# EAGLE design PIC16F877_board (EAGLE 7.2.0)
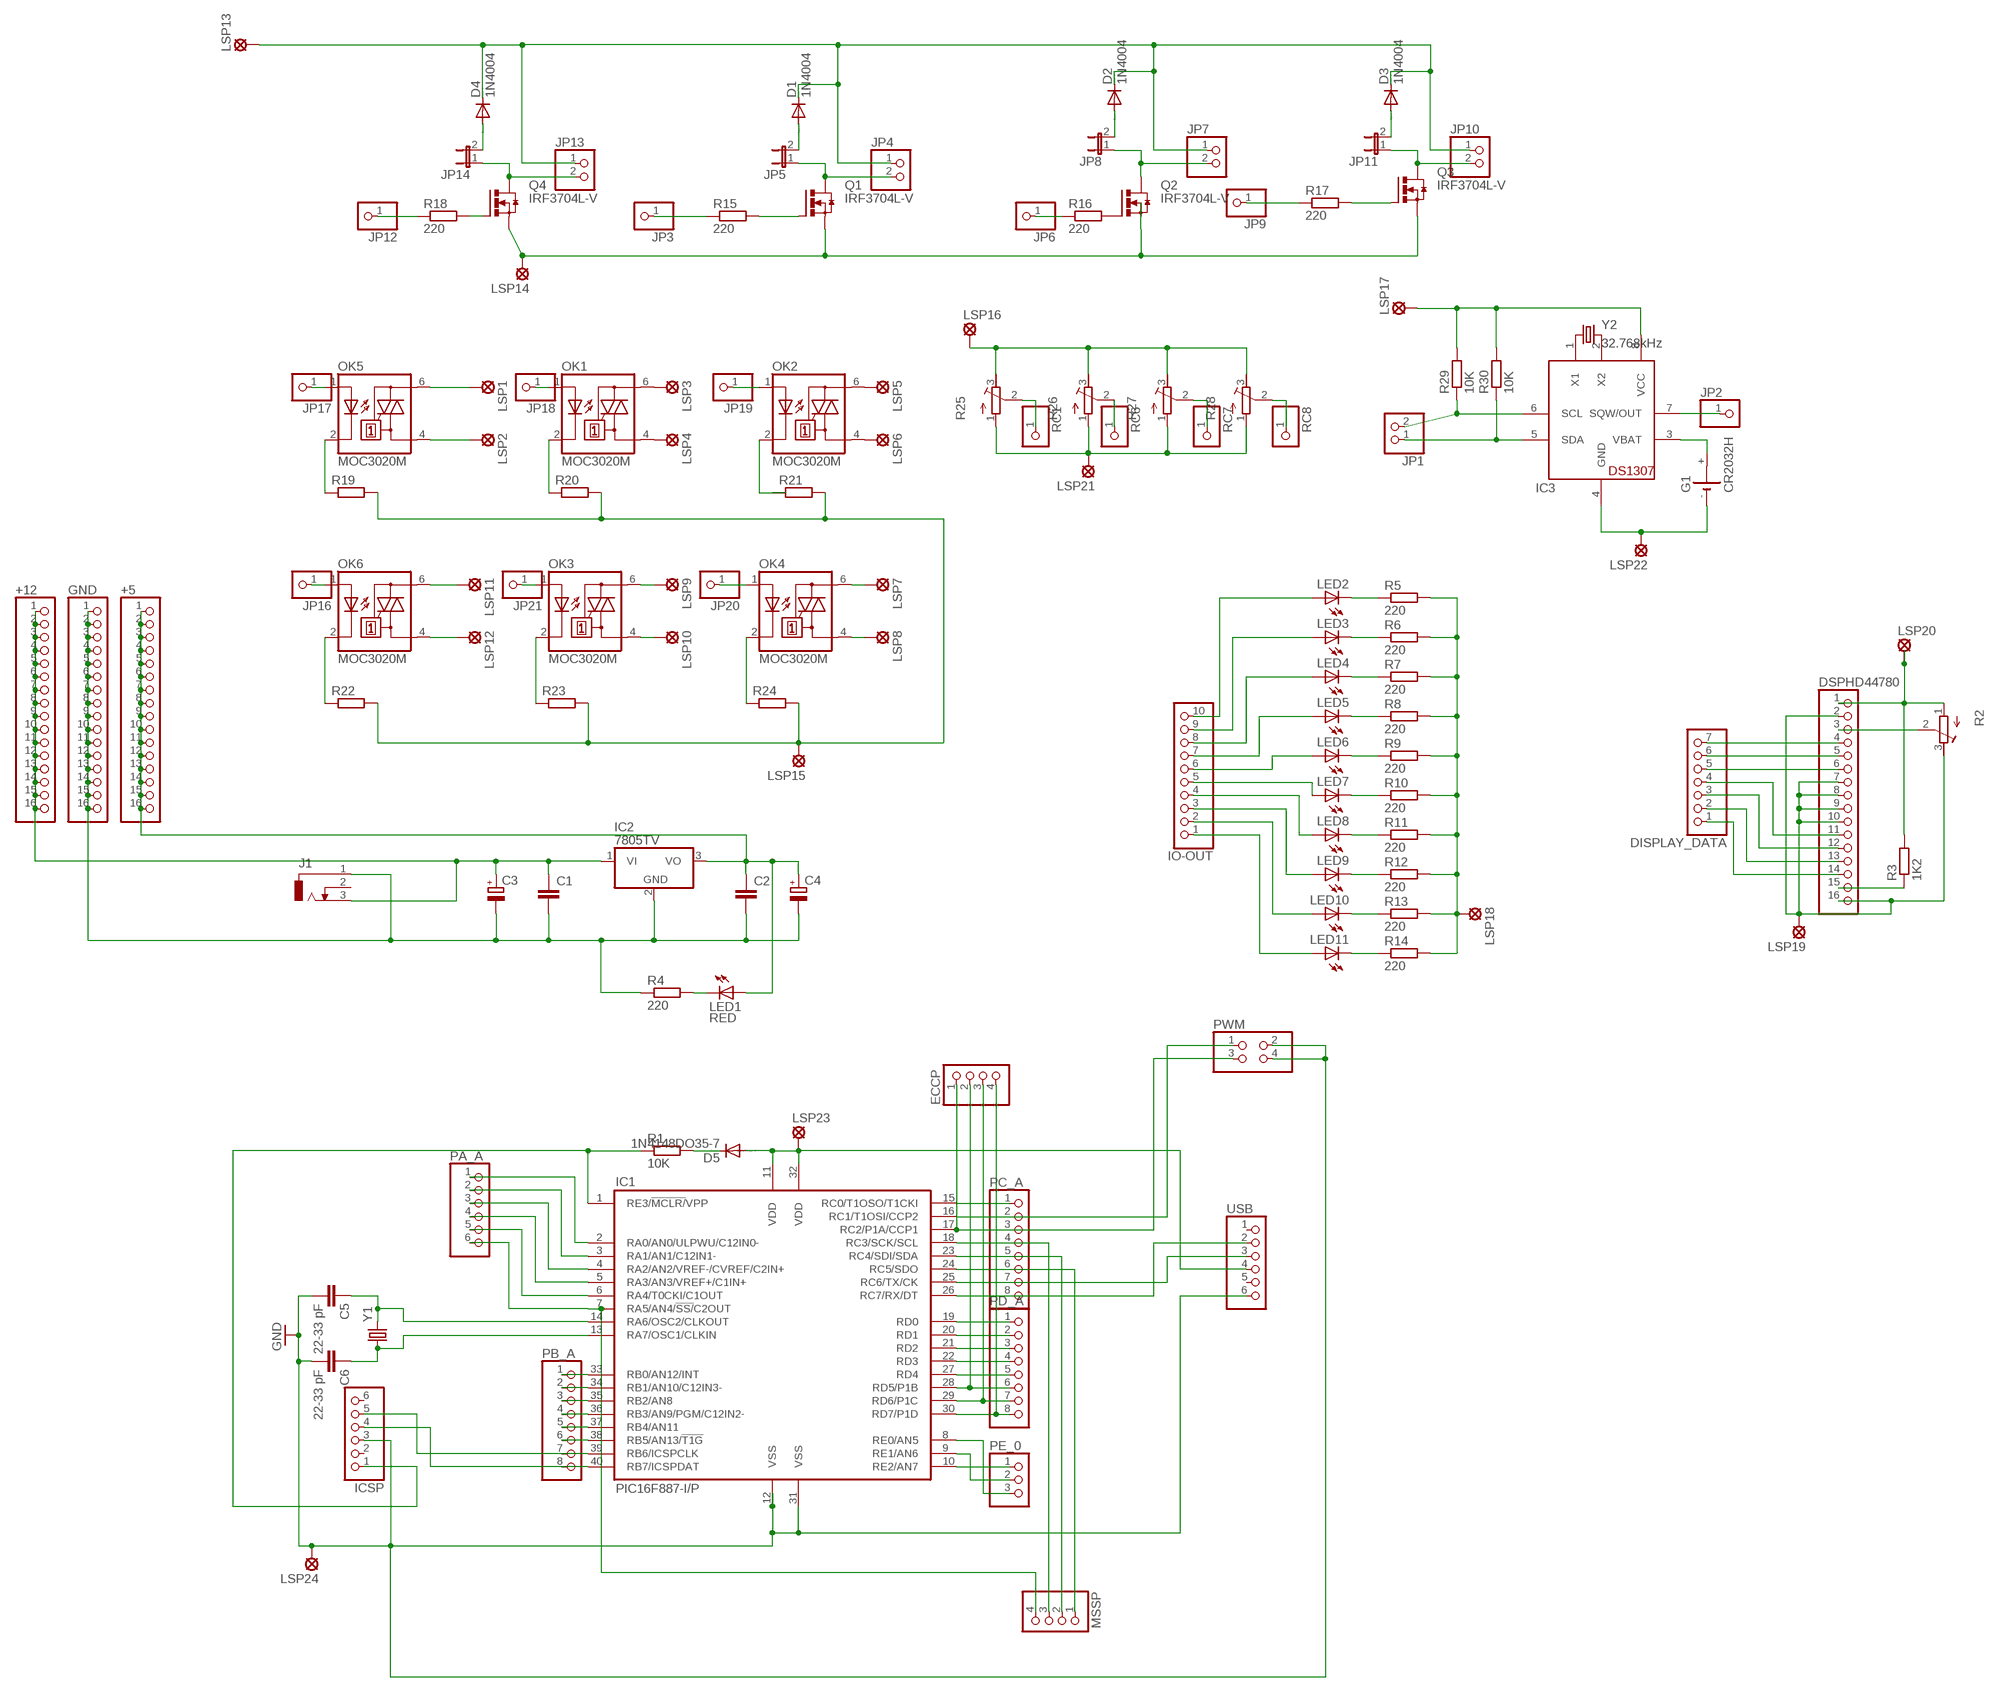
[diagram p0: schematic, sheet 1]

## Parts
+5  PINHD-1X16  [1X16]
+12  PINHD-1X16  [1X16]
C1  C-EU050-025X075  [C050-025X075]
C2  C-EU050-025X075  [C050-025X075]
C3  CPOL-EUE2,5-6E  [E2,5-6E]
C4  CPOL-EUE2,5-6E  [E2,5-6E]
C5  22-33 pF  C-EU025-024X044  [C025-024X044]
C6  22-33 pF  C-EU025-024X044  [C025-024X044]
D1  1N4004  [DO41-10]
D2  1N4004  [DO41-10]
D3  1N4004  [DO41-10]
D4  1N4004  [DO41-10]
D5  1N4148DO35-7  [DO35-7]
DISPLAY_DATA  PINHD-1X7  [1X07]
DSPHD44780  PINHD-1X16  [1X16]
ECCP  PINHD-1X4  [1X04]
G1  CR2032H  [CR2032H]
GND  PINHD-1X16  [1X16]
IC1  PIC16F887-I/P  [DIL40]
IC2  7805TV  [TO220V]
IC3  DS1307  [DIL08]
ICSP  PINHD-1X6  [1X06]
IO-OUT  PINHD-1X10  [1X10]
J1  DCJ0303  [DCJ0303]
JP1  PINHD-1X2  [1X02]
JP2  PINHD-1X1  [1X01]
JP3  PINHD-1X1  [1X01]
JP4  PINHD-1X2  [1X02]
JP5  JP1E  [JP1]
JP6  PINHD-1X1  [1X01]
JP7  PINHD-1X2  [1X02]
JP8  JP1E  [JP1]
JP9  PINHD-1X1  [1X01]
JP10  PINHD-1X2  [1X02]
JP11  JP1E  [JP1]
JP12  PINHD-1X1  [1X01]
JP13  PINHD-1X2  [1X02]
JP14  JP1E  [JP1]
JP16  PINHD-1X1  [1X01]
JP17  PINHD-1X1  [1X01]
JP18  PINHD-1X1  [1X01]
JP19  PINHD-1X1  [1X01]
JP20  PINHD-1X1  [1X01]
JP21  PINHD-1X1  [1X01]
LED1  RED  LED5MM  [LED5MM]
LED2  LED3MM  [LED3MM]
LED3  LED3MM  [LED3MM]
LED4  LED3MM  [LED3MM]
LED5  LED3MM  [LED3MM]
LED6  LED3MM  [LED3MM]
LED7  LED3MM  [LED3MM]
LED8  LED3MM  [LED3MM]
LED9  LED3MM  [LED3MM]
LED10  LED3MM  [LED3MM]
LED11  LED3MM  [LED3MM]
LSP1  LSP10  [LSP10]
LSP2  LSP10  [LSP10]
LSP3  LSP10  [LSP10]
LSP4  LSP10  [LSP10]
LSP5  LSP10  [LSP10]
LSP6  LSP10  [LSP10]
LSP7  LSP10  [LSP10]
LSP8  LSP10  [LSP10]
LSP9  LSP10  [LSP10]
LSP10  LSP10  [LSP10]
LSP11  LSP10  [LSP10]
LSP12  LSP10  [LSP10]
LSP13  LSP10  [LSP10]
LSP14  LSP10  [LSP10]
LSP15  LSP10  [LSP10]
LSP16  LSP10  [LSP10]
LSP17  LSP10  [LSP10]
LSP18  LSP10  [LSP10]
LSP19  LSP10  [LSP10]
LSP20  LSP10  [LSP10]
LSP21  LSP10  [LSP10]
LSP22  LSP10  [LSP10]
LSP23  LSP10  [LSP10]
LSP24  LSP10  [LSP10]
MSSP  PINHD-1X4  [1X04]
OK1  MOC3020M  [DIL06]
OK2  MOC3020M  [DIL06]
OK3  MOC3020M  [DIL06]
OK4  MOC3020M  [DIL06]
OK5  MOC3020M  [DIL06]
OK6  MOC3020M  [DIL06]
PA_A  PINHD-1X6  [1X06]
PB_A  PINHD-1X8  [1X08]
PC_A  PINHD-1X8  [1X08]
PD_A  PINHD-1X8  [1X08]
PE_0  PINHD-1X3  [1X03]
PWM  PINHD-2X2  [2X02]
Q1  IRF3704L-V  [TO262-V]
Q2  IRF3704L-V  [TO262-V]
Q3  IRF3704L-V  [TO262-V]
Q4  IRF3704L-V  [TO262-V]
R1  10K  R-EU_0207/10  [0207/10]
R2  R-TRIMM3339P  [RTRIM3339P]
R3  1K2  R-EU_0207/10  [0207/10]
R4  220  R-EU_0207/10  [0207/10]
R5  220  R-EU_0207/10  [0207/10]
R6  220  R-EU_0207/10  [0207/10]
R7  220  R-EU_0207/10  [0207/10]
R8  220  R-EU_0207/10  [0207/10]
R9  220  R-EU_0207/10  [0207/10]
R10  220  R-EU_0207/10  [0207/10]
R11  220  R-EU_0207/10  [0207/10]
R12  220  R-EU_0207/10  [0207/10]
R13  220  R-EU_0207/10  [0207/10]
R14  220  R-EU_0207/10  [0207/10]
R15  220  R-EU_0207/10  [0207/10]
R16  220  R-EU_0207/10  [0207/10]
R17  220  R-EU_0207/10  [0207/10]
R18  220  R-EU_0207/10  [0207/10]
R19  R-EU_0207/10  [0207/10]
R20  R-EU_0207/10  [0207/10]
R21  R-EU_0207/10  [0207/10]
R22  R-EU_0207/10  [0207/10]
R23  R-EU_0207/10  [0207/10]
R24  R-EU_0207/10  [0207/10]
R25  R-TRIMM3339P  [RTRIM3339P]
R26  R-TRIMM3339P  [RTRIM3339P]
R27  R-TRIMM3339P  [RTRIM3339P]
R28  R-TRIMM3339P  [RTRIM3339P]
R29  10K  R-EU_0207/10  [0207/10]
R30  10K  R-EU_0207/10  [0207/10]
RC1  PINHD-1X1  [1X01]
RC6  PINHD-1X1  [1X01]
RC7  PINHD-1X1  [1X01]
RC8  PINHD-1X1  [1X01]
USB  PINHD-1X6  [1X06]
Y1  CRYSTALHC49UV  [HC49U-V]
Y2  32.768kHz  CRYSTALTC26V  [TC26V]

## Nets
GND: C5.2 C6.2 IC1.12(VSS) IC1.31(VSS) ICSP.3 LSP24.MP PWM.2 PWM.4 USB.6
N$1: C5.1 IC1.14(RA6/OSC2/CLKOUT) Y1.2
N$2: LED1.K(C) R4.2
N$3: IC1.15(RC0/T1OSO/T1CKI) PC_A.1
N$4: IC1.33(RB0/AN12/INT) PB_A.1
N$5: IC1.34(RB1/AN10/C12IN3-) PB_A.2
N$6: IC1.35(RB2/AN8) PB_A.3
N$7: IC1.36(RB3/AN9/PGM/C12IN2-) PB_A.4
N$8: IC1.2(RA0/AN0/ULPWU/C12IN0-) PA_A.1
N$9: IC1.3(RA1/AN1/C12IN1-) PA_A.2
N$10: IC1.4(RA2/AN2/VREF-/CVREF/C2IN+) PA_A.3
N$11: IC1.5(RA3/AN3/VREF+/C1IN+) PA_A.4
N$12: IC1.6(RA4/T0CKI/C1OUT) PA_A.5
N$13: IC1.7(RA5/AN4/!SS/!C2OUT) MSSP.4 PA_A.6
N$14: DISPLAY_DATA.5 DSPHD44780.6
N$15: IC1.1(RE3/!MCLR/!VPP) ICSP.1 R1.1
N$16: DISPLAY_DATA.6 DSPHD44780.5
N$17: IC1.19(RD0) PD_A.1
N$18: IC1.37(RB4/AN11) PB_A.5
N$19: IC1.38(RB5/AN13/!T1G) PB_A.6
N$20: IC1.39(RB6/ICSPCLK) ICSP.5 PB_A.7
N$21: IC1.40(RB7/ICSPDAT) ICSP.4 PB_A.8
N$22: DSPHD44780.15 R3.1
N$23: IC1.20(RD1) PD_A.2
N$24: IC1.16(RC1/T1OSI/CCP2) PC_A.2 PWM.1
N$25: C6.1 IC1.13(RA7/OSC1/CLKIN) Y1.1
N$26: C1.2 C2.2 C3.- C4.- GND.1 GND.2 GND.3 GND.4 GND.5 GND.6 GND.7 GND.8 GND.9 GND.10 GND.11 GND.12 GND.13 GND.14 GND.15 GND.16 IC2.2(GND) J1.1 R4.1
N$27: IC1.18(RC3/SCK/SCL) MSSP.3 PC_A.4
N$28: IC1.23(RC4/SDI/SDA) MSSP.2 PC_A.5
N$29: IC1.24(RC5/SDO) MSSP.1 PC_A.6
N$30: IC1.25(RC6/TX/CK) PC_A.7 USB.3
N$31: IC1.26(RC7/RX/DT) PC_A.8 USB.2
N$32: IC1.21(RD2) PD_A.3
N$33: IC1.22(RD3) PD_A.4
N$34: IC1.27(RD4) PD_A.5
N$35: ECCP.2 IC1.28(RD5/P1B) PD_A.6
N$36: ECCP.3 IC1.29(RD6/P1C) PD_A.7
N$37: ECCP.4 IC1.30(RD7/P1D) PD_A.8
N$38: ECCP.1 IC1.17(RC2/P1A/CCP1) PC_A.3 PWM.3
N$39: JP17.1 OK5.1(A)
N$40: Q1.1(G) R15.2
N$41: LED2.K(C) R5.1
N$42: LED3.K(C) R6.1
N$43: LED4.K(C) R7.1
N$44: LED5.K(C) R8.1
N$45: LED6.K(C) R9.1
N$46: LED7.K(C) R10.1
N$47: LED8.K(C) R11.1
N$48: LED9.K(C) R12.1
N$49: LED10.K(C) R13.1
N$50: LED11.K(C) R14.1
N$51: JP3.1 R15.1
N$52: IO-OUT.10 LED2.A
N$53: IO-OUT.9 LED3.A
N$54: IO-OUT.8 LED4.A
N$55: IO-OUT.7 LED5.A
N$56: IO-OUT.6 LED6.A
N$57: IO-OUT.5 LED7.A
N$58: IO-OUT.4 LED8.A
N$59: IO-OUT.3 LED9.A
N$60: IO-OUT.2 LED10.A
N$61: IO-OUT.1 LED11.A
N$62: JP4.2 JP5.1 Q1.2(D)
N$63: JP18.1 OK1.1(A)
N$64: JP19.1 OK2.1(A)
N$65: D1.A JP5.2
N$66: JP20.1 OK4.1(A)
N$67: Q2.1(G) R16.2
N$68: JP6.1 R16.1
N$69: JP7.2 JP8.1 Q2.2(D)
N$70: D2.A JP8.2
N$71: Q3.1(G) R17.2
N$72: JP9.1 R17.1
N$73: JP10.2 JP11.1 Q3.2(D)
N$74: D3.A JP11.2
N$75: Q4.1(G) R18.2
N$76: JP12.1 R18.1
N$77: JP13.2 JP14.1 Q4.2(D)
N$78: D4.A JP14.2
N$79: LSP1.MP OK5.6(A2)
N$80: LSP2.MP OK5.4(A1)
N$81: LSP3.MP OK1.6(A2)
N$82: LSP4.MP OK1.4(A1)
N$83: LSP5.MP OK2.6(A2)
N$84: LSP6.MP OK2.4(A1)
N$85: LSP7.MP OK4.6(A2)
N$86: LSP8.MP OK4.4(A1)
N$87: LSP9.MP OK3.6(A2)
N$88: LSP10.MP OK3.4(A1)
N$89: LSP11.MP OK6.6(A2)
N$90: LSP12.MP OK6.4(A1)
N$91: JP21.1 OK3.1(A)
N$92: OK2.2(C) R21.1
N$93: OK1.2(C) R20.1
N$94: OK5.2(C) R19.1
N$95: JP16.1 OK6.1(A)
N$96: OK3.2(C) R23.1
N$97: OK4.2(C) R24.1
N$98: OK6.2(C) R22.1
N$99: DISPLAY_DATA.1 DSPHD44780.14
N$100: R25.2(S) RC1.1
N$101: R26.2(S) RC6.1
N$102: R27.2(S) RC7.1
N$103: R28.2(S) RC8.1
N$104: DISPLAY_DATA.2 DSPHD44780.13
N$105: DISPLAY_DATA.3 DSPHD44780.12
N$106: DISPLAY_DATA.4 DSPHD44780.11
N$107: DISPLAY_DATA.7 DSPHD44780.4
N$108: IC1.9(RE1/AN6) PE_0.2
N$109: DSPHD44780.3 R2.2(S)
N$110: IC1.8(RE0/AN5) PE_0.3
N$111: IC1.10(RE2/AN7) PE_0.1
N$112: D5.C R1.2
N$113: IC3.6(SCL) JP1.2 R29.1
N$114: IC3.5(SDA) JP1.1 R30.1
N$115: IC3.8(VCC) LSP17.MP R29.2 R30.2
N$116: IC3.7(SQW/OUT) JP2.1
N$117: G1.+ IC3.3(VBAT)
N$118: D1.C D2.C D3.C D4.C JP4.1 JP7.1 JP10.1 JP13.1 LSP13.MP
N$119: LSP14.MP Q1.3(S) Q2.3(S) Q3.3(S) Q4.3(S)
N$120: IC3.1(X1) Y2.1
N$121: IC3.2(X2) Y2.2
N$122: LSP15.MP R19.2 R20.2 R21.2 R22.2 R23.2 R24.2
N$123: LSP18.MP R5.2 R6.2 R7.2 R8.2 R9.2 R10.2 R11.2 R12.2 R13.2 R14.2
N$124: LSP16.MP R25.3(E) R26.3(E) R27.3(E) R28.3(E)
N$125: DSPHD44780.1 LSP20.MP R2.1(A) R3.2
N$126: DSPHD44780.2 DSPHD44780.7 DSPHD44780.8 DSPHD44780.9 DSPHD44780.10 DSPHD44780.16 LSP19.MP R2.3(E)
N$127: G1.- IC3.4(GND) LSP22.MP
N$128: LSP21.MP R25.1(A) R26.1(A) R27.1(A) R28.1(A)
N$129: +12.1 +12.2 +12.3 +12.4 +12.5 +12.6 +12.7 +12.8 +12.9 +12.10 +12.11 +12.12 +12.13 +12.14 +12.15 +12.16 C1.1 C3.+ IC2.1(VI) J1.3
N$130: D5.A IC1.11(VDD) IC1.32(VDD) LSP23.MP USB.4
N$131: +5.1 +5.2 +5.3 +5.4 +5.5 +5.6 +5.7 +5.8 +5.9 +5.10 +5.11 +5.12 +5.13 +5.14 +5.15 +5.16 C2.1 C4.+ IC2.3(VO) LED1.A
Unconnected: G1.+@1(+) ICSP.2 ICSP.6 J1.2 USB.1 USB.5

## Library data of the parts
+5 +12 DSPHD44780 GND = pinhead:PINHD-1X16: PIN HEADER
C1 C2 = resistor:C-EU: CAPACITOR, European symbol
C3 C4 = rcl:CPOL-EU: POLARIZED CAPACITOR, European symbol
C5 C6 = rcl:C-EU: CAPACITOR, European symbol
D1-D4 = diode:1N4004: DIODE general purpose rectifier, 1 A
D5 = diode:1N4148: DIODE high speed (Philips)
DISPLAY_DATA = pinhead:PINHD-1X7: PIN HEADER
ECCP MSSP = pinhead:PINHD-1X4: PIN HEADER
G1 = battery:CR2032H: LI BATTERY Varta
IC1 = microchip-pic16f887:PIC16F887: The library has been designed by Richard Magdycz <https://www.facebook.com/groups/eaglecadsoftUK>
IC2 = linear:78*: Positive VOLTAGE REGULATOR Source: http://cache.national.com/ds/LM/LM78L05.pdf http://www.fairchildsemi.com/ds/LM/LM7805.pdf
IC3 = adafruit:DS1307: DS1307 Real time clock (RTC) with battery backup ability. Talk to it via i2c
ICSP PA_A USB = pinhead:PINHD-1X6: PIN HEADER
IO-OUT = pinhead:PINHD-1X10: PIN HEADER
J1 = con-jack:DCJ0303: DC POWER JACK Source: DCJ0303.pdf; OC_FARNELL: unknown; OC_NEWARK: unknown
JP1 JP4 JP7 JP10 JP13 = pinhead:PINHD-1X2: PIN HEADER
JP2 JP3 JP6 JP9 JP12 JP16-JP21 RC1 RC6-RC8 = pinhead:PINHD-1X1: PIN HEADER
JP5 JP8 JP11 JP14 = jumper:JP1E: JUMPER
LED1-LED11 = led:LED: LED OSRAM: - CHIPLED LG R971, LG N971, LY N971, LG Q971, LY Q971, LO R971, LY R971 LH N974, LH R974 LS Q976, LO Q976, LY Q976 LO Q996 - Hyper CHIPLED LW Q18S LB Q993, LB Q99A, LB R99A - SideLED LS A670, LO A670, LY A670, LG A670, LP A670 LB A673, LV A673, LT A673, LW A673 LH A674 LY A675 LS A676, LA A676, LO A676, LY A676, LW A676 LS A679, LY A679, LG A679 - Hyper Micro SIDELED® LS Y876, LA Y876, LO Y876, LY Y876 LT Y87S - SmartLED LW L88C, LW L88S LB L89C, LB L89S, LG L890 LS L89K, LO L89K, LY L89K LS L896, LA L896, LO L896, LY L896 - TOPLED LS T670, LO T670, LY T670, LG T670, LP T670 LSG T670, LSP T670, LSY T670, LOP T670, LYG T670 LG T671, LOG T671, LSG T671 LB T673, LV T673, LT T673, LW T673 LH T674 LS T676, LA T676, LO T676, LY T676, LB T676, LH T676, LSB T676, LW T676 LB T67C, LV T67C, LT T67C, LS T67K, LO T67K, LY T67K, LW E67C LS E67B, LA E67B, LO E67B, LY E67B, LB E67C, LV E67C, LT E67C LW T67C LS T679, LY T679, LG T679 LS T770, LO T770, LY T770, LG T770, LP T770 LB T773, LV T773, LT T773, LW T773 LH T774 LS E675, LA E675, LY E675, LS T675 LS T776, LA T776, LO T776, LY T776, LB T776 LHGB T686 LT T68C, LB T68C - Hyper Mini TOPLED® LB M676 - Mini TOPLED Santana® LG M470 LS M47K, LO M47K, LY M47K Source: http://www.osram.convergy.de LUXEON: - LUMILED® LXK2-PW12-R00, LXK2-PW12-S00, LXK2-PW14-U00, LXK2-PW14-V00 LXK2-PM12-R00, LXK2-PM12-S00, LXK2-PM14-U00 LXK2-PE12-Q00, LXK2-PE12-R00, LXK2-PE12-S00, LXK2-PE14-T00, LXK2-PE14-U00 LXK2-PB12-K00, LXK2-PB12-L00, LXK2-PB12-M00, LXK2-PB14-N00, LXK2-PB14-P00, LXK2-PB14-Q00 LXK2-PR12-L00, LXK2-PR12-M00, LXK2-PR14-Q00, LXK2-PR14-R00 LXK2-PD12-Q00, LXK2-PD12-R00, LXK2-PD12-S00 LXK2-PH12-R00, LXK2-PH12-S00 LXK2-PL12-P00, LXK2-PL12-Q00, LXK2-PL12-R00 Source: www.luxeon.com KINGBRIGHT: KA-3528ASYC Source: www.kingbright.com
LSP1-LSP24 = solpad:LSP10: SOLDER PAD drill 1.0 mm, distributor Buerklin, 12H555
OK1-OK6 = optocoupler:MOC30*M: RANDOM-PHASE OPTOISOLATORS TRIAC DRIVER OUTPUT Source: http://www.fairchildsemi.com MOC3020-M.pdf; MF: FAIRCHILD SEMICONDUCTOR; MPN: MOC3020-M; OC_FARNELL: 1505425; OC_NEWARK: 72K8895
PB_A PC_A PD_A = pinhead:PINHD-1X8: PIN HEADER
PE_0 = pinhead:PINHD-1X3: PIN HEADER
PWM = pinhead:PINHD-2X2: PIN HEADER
Q1-Q4 = transistor-power:IRF3704: SMPS MOSFET HEXFET® Power MOSFET Source: http://www.irf.com/product-info/datasheets/data/irf3704.pdf
R1 R3 R4 R19-R24 R29 R30 = resistor:R-EU_: RESISTOR, European symbol
R2 = rcl:R-TRIMM: Trimm resistor
R5-R18 = rcl:R-EU_: RESISTOR, European symbol
R25-R28 = resistor:R-TRIMM: Trimm resistor
Y1 = SparkFun-FreqCtrl:CRYSTAL: Various standard crystals. Proven footprints.
Y2 = adafruit:CRYSTAL: CRYSTAL; OC_FARNELL: unknown; OC_NEWARK: unknown

## Board
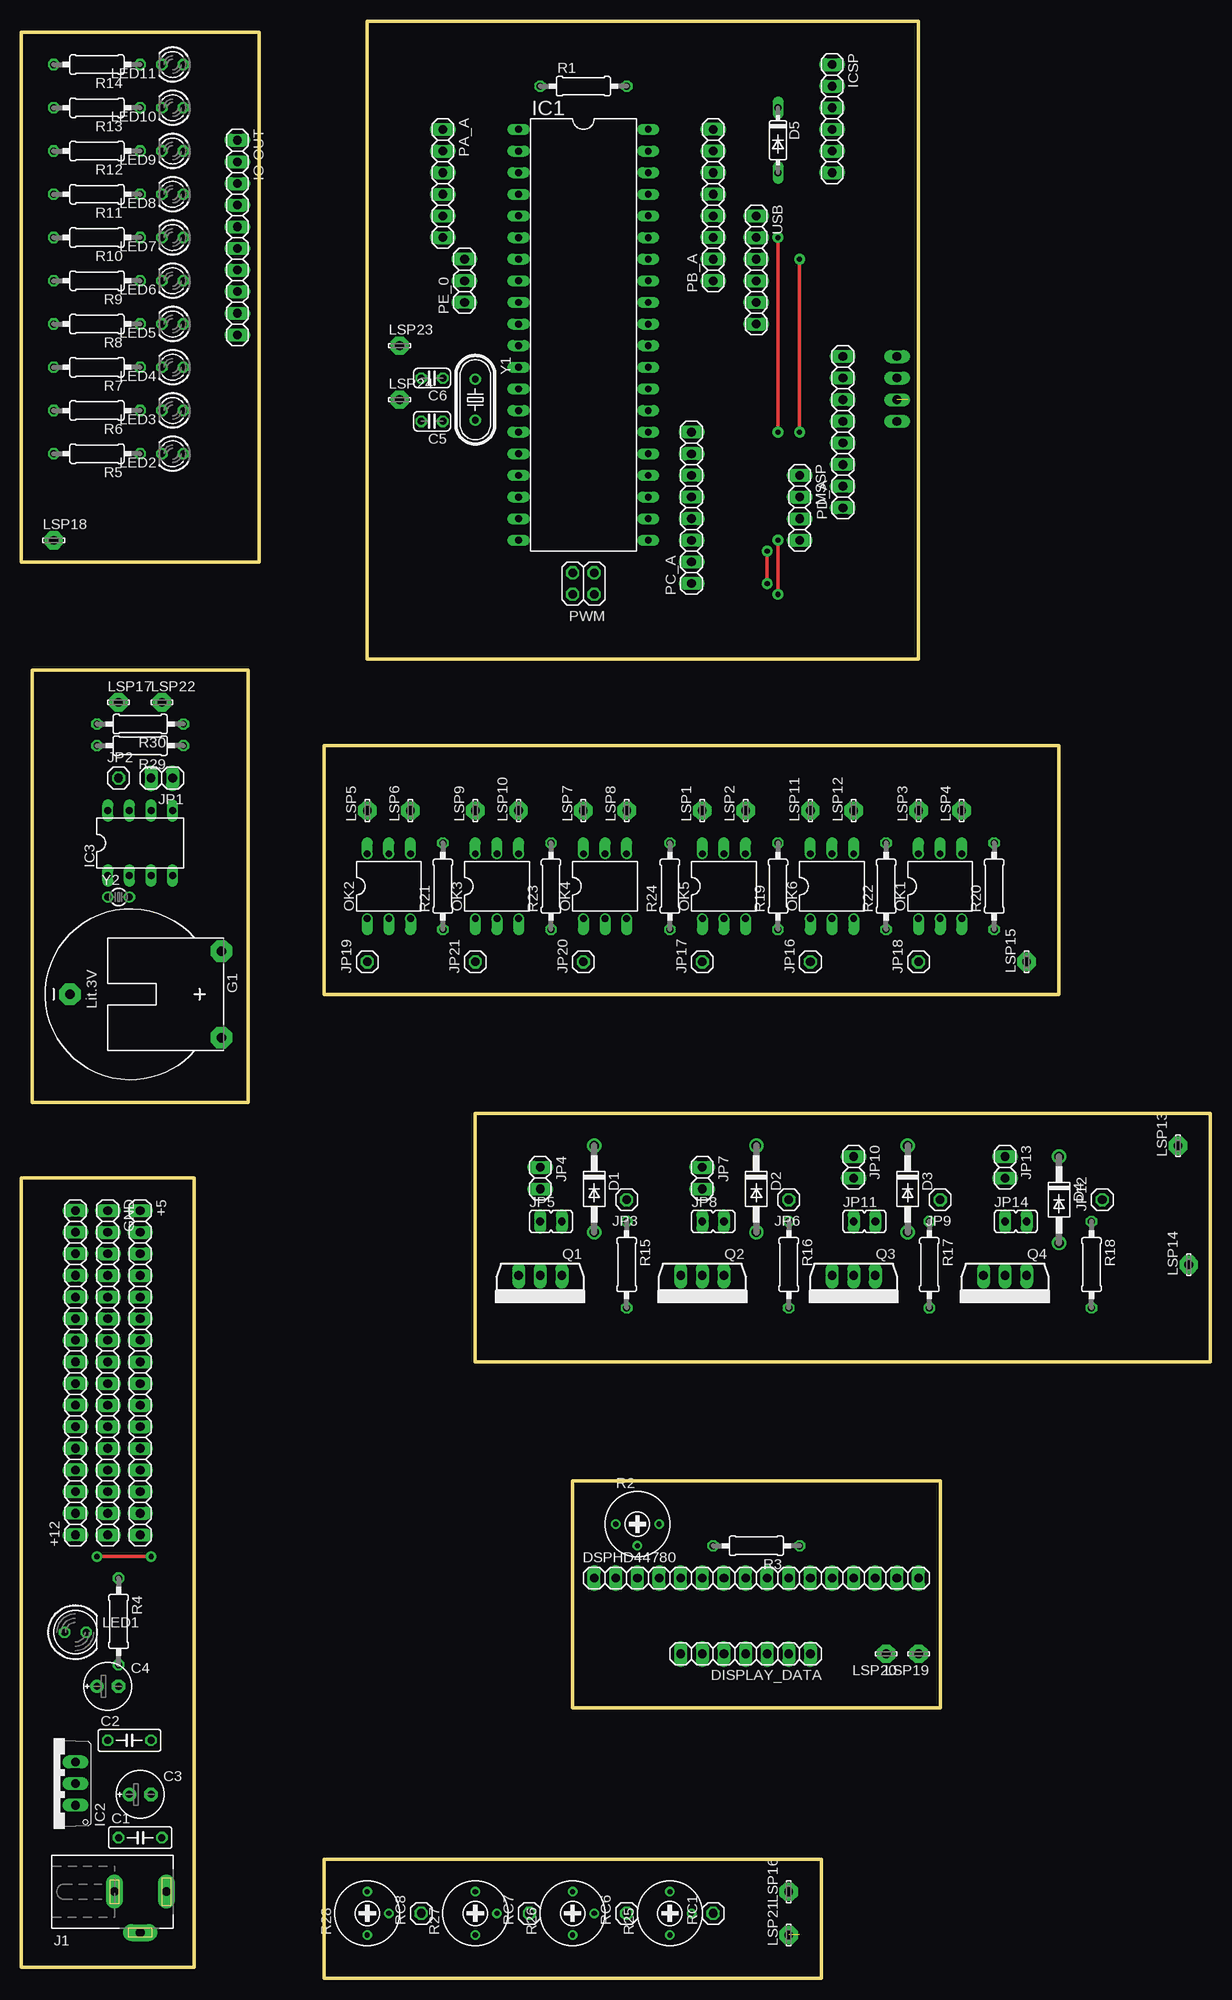
[diagram p1: board, top side]
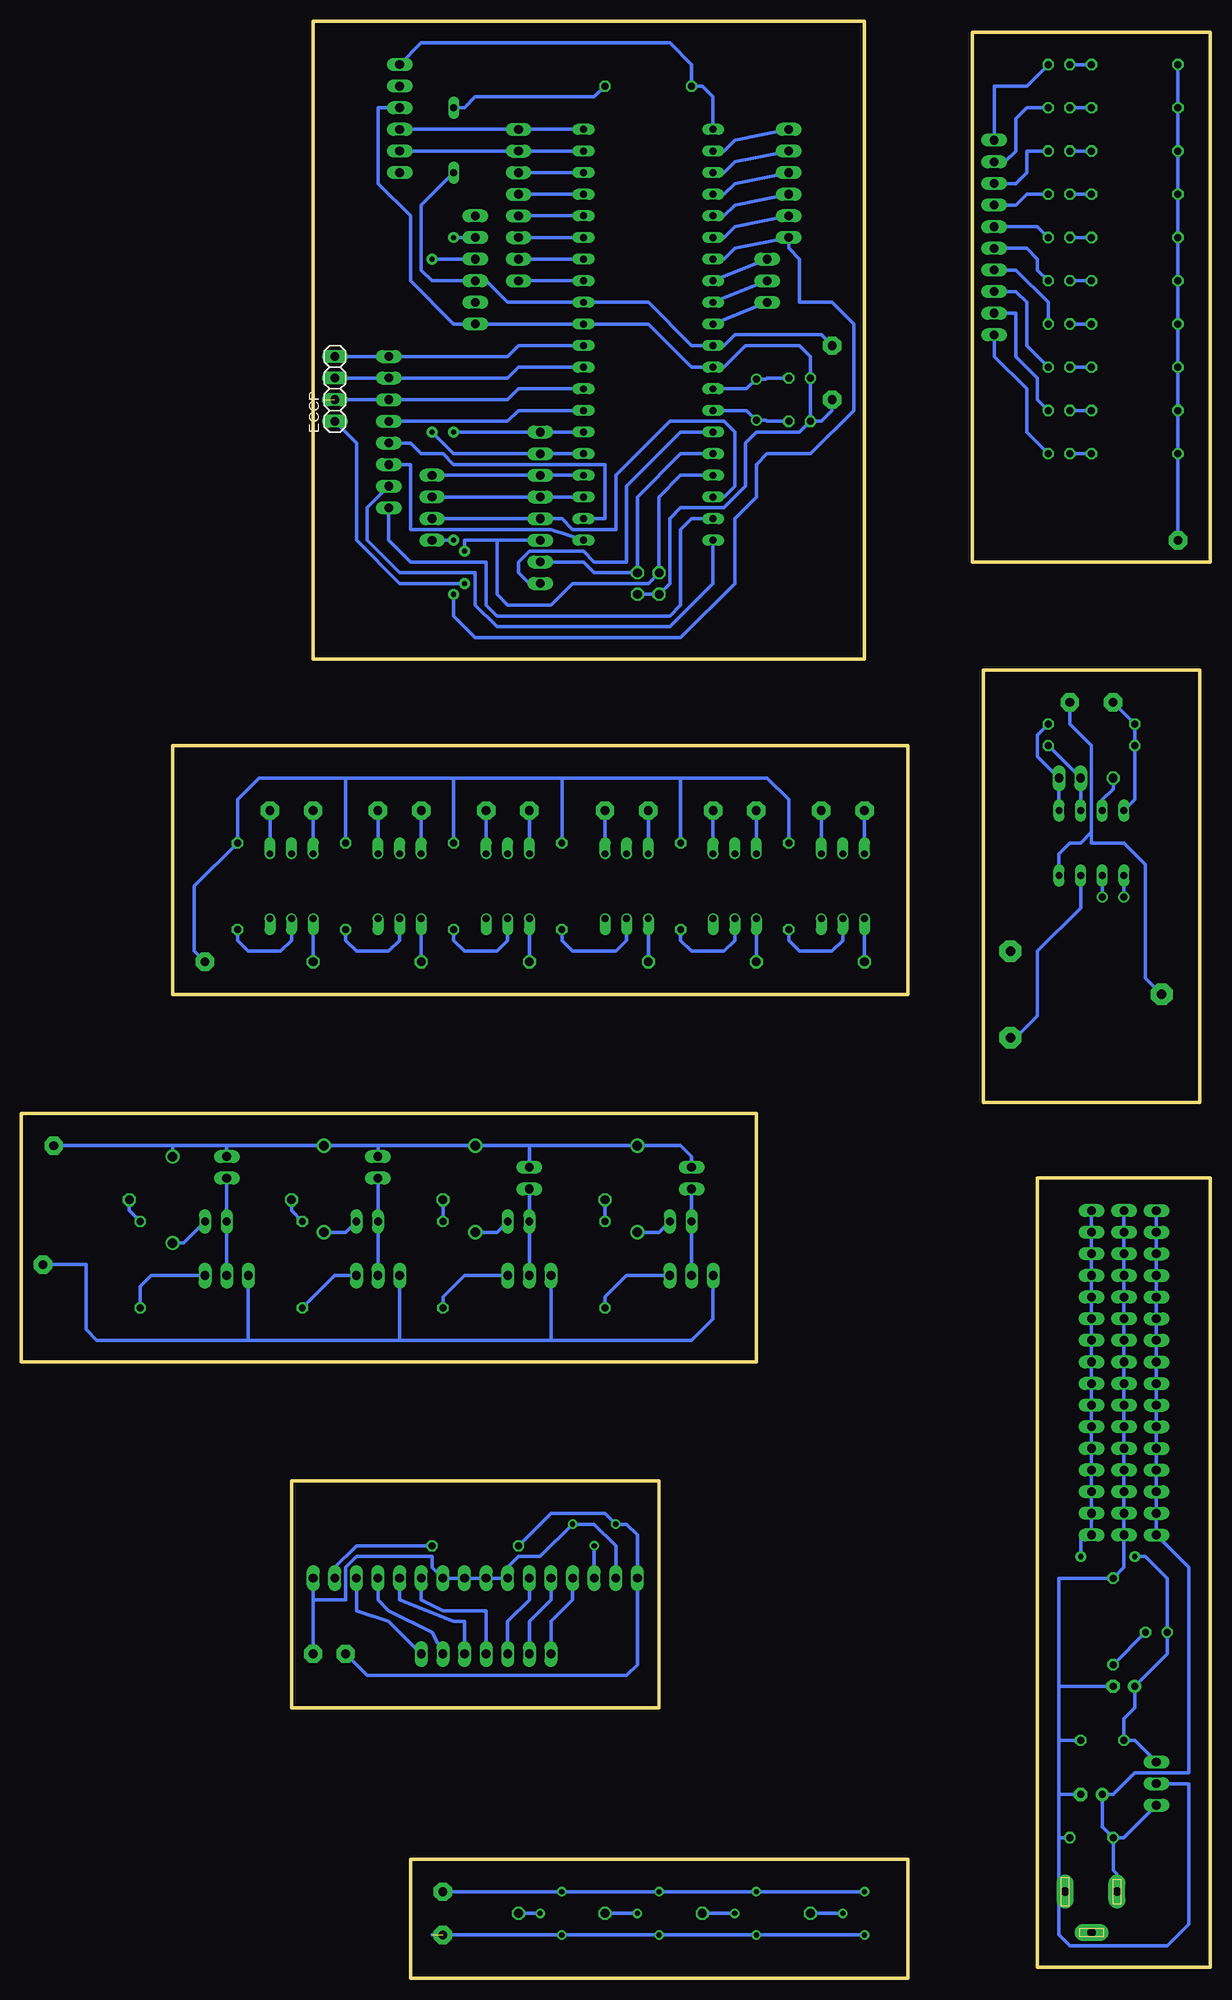
[diagram p2: board, bottom side, seen from below]

Size 139.7 x 229.87 mm. Coordinates in mm from the lower left corner, seen from the top.
Outline: 107.95,31.75 64.77,31.75 64.77,58.42 107.95,58.42 107.95,31.75
Outline: 1.27,102.87 1.27,153.67 26.67,153.67 26.67,102.87 1.27,102.87
Outline: 53.34,72.39 139.7,72.39 139.7,101.6 53.34,101.6 53.34,72.39
Outline: 0,228.6 27.94,228.6 27.94,166.37 0,166.37 0,228.6
Outline: 35.56,0 35.56,13.97 93.98,13.97 93.98,0 35.56,0
Outline: 35.56,115.57 35.56,144.78 121.92,144.78 121.92,115.57 35.56,115.57
Outline: 20.32,1.27 20.32,93.98 0,93.98 0,1.27 20.32,1.27
Outline: 40.64,229.87 105.41,229.87 105.41,154.94 40.64,154.94 40.64,229.87
Copper layers (1*16): Top 0.035mm / dielectric 1.5mm / Bottom 0.035mm
Design rules "default": minimum track width 10mil, minimum drill 24mil, track to track 8mil, track to pad 8mil, pad to pad 8mil, via to via 8mil, smd to smd 8mil, copper to edge 40mil, drill to drill 8mil, minimum pad ring 10mil, minimum via ring 8mil, stop-mask expansion 4mil, vias tented up to drill 0mil, thermal gap 10mil

### Footprints (pad centres in the part's own frame; a part is rotated, then mirrored left to right if it is on the bottom)
1X16 = drill 1.016 long: 1 -19.05,0; 2 -16.51,0; 3 -13.97,0; 4 -11.43,0; 5 -8.89,0; 6 -6.35,0; 7 -3.81,0; 8 -1.27,0; 9 1.27,0; 10 3.81,0; 11 6.35,0; 12 8.89,0; 13 11.43,0; 14 13.97,0; 15 16.51,0; 16 19.05,0
C050-025X075 = drill 0.813 octagon: 1 -2.54,0; 2 2.54,0
E2,5-6E = drill 0.813 pad 1.575: + -1.27,0 | drill 0.813 pad 1.575 octagon: - 1.27,0
C025-024X044 = drill 0.813 octagon: 1 -1.27,0; 2 1.27,0
DO41-10 = drill 1.118: A 5.08,0; C -5.08,0
DO35-7 = drill 0.813 long: A 3.81,0; C -3.81,0
1X07 = drill 1.016 long: 1 -7.62,0; 2 -5.08,0; 3 -2.54,0; 4 0,0; 5 2.54,0; 6 5.08,0; 7 7.62,0
1X04 = drill 1.016 long: 1 -3.81,0; 2 -1.27,0; 3 1.27,0; 4 3.81,0
CR2032H = drill 1.118 pad 2.54 octagon: + 5.08,10.795; +@1 -5.08,10.795; - 0,-6.985
DIL40 = drill 0.813 long: 1 -24.13,-7.62; 2 -21.59,-7.62; 3 -19.05,-7.62; 4 -16.51,-7.62; 5 -13.97,-7.62; 6 -11.43,-7.62; 7 -8.89,-7.62; 8 -6.35,-7.62; 9 -3.81,-7.62; 10 -1.27,-7.62; 11 1.27,-7.62; 12 3.81,-7.62; 13 6.35,-7.62; 14 8.89,-7.62; 15 11.43,-7.62; 16 13.97,-7.62; 17 16.51,-7.62; 18 19.05,-7.62; 19 21.59,-7.62; 20 24.13,-7.62; 21 24.13,7.62; 22 21.59,7.62; 23 19.05,7.62; 24 16.51,7.62; 25 13.97,7.62; 26 11.43,7.62; 27 8.89,7.62; 28 6.35,7.62; 29 3.81,7.62; 30 1.27,7.62; 31 -1.27,7.62; 32 -3.81,7.62; 33 -6.35,7.62; 34 -8.89,7.62; 35 -11.43,7.62; 36 -13.97,7.62; 37 -16.51,7.62; 38 -19.05,7.62; 39 -21.59,7.62; 40 -24.13,7.62
TO220V = drill 1.016 long: 1 -2.54,-2.54; 2 0,-2.54; 3 2.54,-2.54
DIL08 = drill 0.813 long: 1 -3.81,-3.81; 2 -1.27,-3.81; 3 1.27,-3.81; 4 3.81,-3.81; 5 3.81,3.81; 6 1.27,3.81; 7 -1.27,3.81; 8 -3.81,3.81
1X06 = drill 1.016 long: 1 -6.35,0; 2 -3.81,0; 3 -1.27,0; 4 1.27,0; 5 3.81,0; 6 6.35,0
1X10 = drill 1.016 long: 1 -11.43,0; 2 -8.89,0; 3 -6.35,0; 4 -3.81,0; 5 -1.27,0; 6 1.27,0; 7 3.81,0; 8 6.35,0; 9 8.89,0; 10 11.43,0
DCJ0303 = drill 1 pad 2 long: 1 0,3.1; 2 4.8,0; 3 0,-3
1X02 = drill 1.016 long: 1 -1.27,0; 2 1.27,0
1X01 = drill 1.016 octagon: 1 0,0
JP1 = drill 0.914 long: 1 0,-1.27; 2 0,1.27
LED5MM = drill 0.813 octagon: A -1.27,0; K 1.27,0
LED3MM = drill 0.813 octagon: A -1.27,0; K 1.27,0
LSP10 = drill 1.016 pad 2.159 octagon: MP 0,0
DIL06 = drill 0.813 offset: 1 -2.54,-3.81; 2 0,-3.81; 3 2.54,-3.81; 4 2.54,3.81; 5 0,3.81; 6 -2.54,3.81
1X08 = drill 1.016 long: 1 -8.89,0; 2 -6.35,0; 3 -3.81,0; 4 -1.27,0; 5 1.27,0; 6 3.81,0; 7 6.35,0; 8 8.89,0
1X03 = drill 1.016 long: 1 -2.54,0; 2 0,0; 3 2.54,0
2X02 = drill 1.016 octagon: 1 -1.27,-1.27; 2 -1.27,1.27; 3 1.27,-1.27; 4 1.27,1.27
TO262-V = drill 1.016 long: 1 -2.54,0; 2 0,0; 3 2.54,0
0207/10 = drill 0.813 octagon: 1 -5.08,0; 2 5.08,0
RTRIM3339P = drill 0.61: 1 -2.54,0; 2 0,-2.54; 3 2.54,0
HC49U-V = drill 0.813: 1 -2.413,0; 2 2.413,0
TC26V = drill 0.813: 1 -1.27,0; 2 1.27,0

### Placement (x,y rotation side)
+5  13.97,71.12 270 top
+12  6.35,71.12 90 top
C1  13.97,16.51 0 top
C2  12.7,27.94 0 top
C3  13.97,21.59 0 top
C4  10.16,34.29 0 top
C5  48.26,182.88 180 top
C6  48.26,187.96 180 top
D1  67.31,92.71 270 top
D2  86.36,92.71 270 top
D3  104.14,92.71 270 top
D4  121.92,91.44 270 top
D5  88.9,215.9 270 top
DISPLAY_DATA  85.09,38.1 180 top
DSPHD44780  86.36,46.99 0 top
ECCP  102.87,186.69 90 bottom
G1  12.7,115.57 270 top
GND  10.16,71.12 270 top
IC1  66.04,193.04 270 top
IC2  3.81,22.86 90 top
IC3  13.97,133.35 0 top
ICSP  95.25,218.44 270 top
IO-OUT  25.4,204.47 270 top
J1  13.97,10.16 270 top
JP1  16.51,140.97 180 top
JP2  11.43,140.97 0 top
JP3  71.12,91.44 180 top
JP4  60.96,93.98 270 top
JP5  62.23,88.9 270 top
JP6  90.17,91.44 180 top
JP7  80.01,93.98 270 top
JP8  81.28,88.9 270 top
JP9  107.95,91.44 180 top
JP10  97.79,95.25 270 top
JP11  99.06,88.9 270 top
JP12  127,91.44 90 top
JP13  115.57,95.25 270 top
JP14  116.84,88.9 270 top
JP16  92.71,119.38 90 top
JP17  80.01,119.38 90 top
JP18  105.41,119.38 90 top
JP19  40.64,119.38 90 top
JP20  66.04,119.38 90 top
JP21  53.34,119.38 90 top
LED1  6.35,40.64 0 top
LED2  17.78,179.07 180 top
LED3  17.78,184.15 180 top
LED4  17.78,189.23 180 top
LED5  17.78,194.31 180 top
LED6  17.78,199.39 180 top
LED7  17.78,204.47 180 top
LED8  17.78,209.55 180 top
LED9  17.78,214.63 180 top
LED10  17.78,219.71 180 top
LED11  17.78,224.79 180 top
LSP1  80.01,137.16 90 top
LSP2  85.09,137.16 90 top
LSP3  105.41,137.16 90 top
LSP4  110.49,137.16 90 top
LSP5  40.64,137.16 90 top
LSP6  45.72,137.16 90 top
LSP7  66.04,137.16 90 top
LSP8  71.12,137.16 90 top
LSP9  53.34,137.16 90 top
LSP10  58.42,137.16 90 top
LSP11  92.71,137.16 90 top
LSP12  97.79,137.16 90 top
LSP13  135.89,97.79 90 top
LSP14  137.16,83.82 90 top
LSP15  118.11,119.38 90 top
LSP16  90.17,10.16 90 top
LSP17  11.43,149.86 0 top
LSP18  3.81,168.91 0 top
LSP19  105.41,38.1 180 top
LSP20  101.6,38.1 180 top
LSP21  90.17,5.08 90 top
LSP22  16.51,149.86 0 top
LSP23  44.45,191.77 0 top
LSP24  44.45,185.42 0 top
MSSP  91.44,172.72 270 top
OK1  107.95,128.27 0 top
OK2  43.18,128.27 0 top
OK3  55.88,128.27 0 top
OK4  68.58,128.27 0 top
OK5  82.55,128.27 0 top
OK6  95.25,128.27 0 top
PA_A  49.53,210.82 270 top
PB_A  81.28,208.28 90 top
PC_A  78.74,172.72 90 top
PD_A  96.52,181.61 90 top
PE_0  52.07,199.39 90 top
PWM  66.04,163.83 180 top
Q1  60.96,82.55 180 top
Q2  80.01,82.55 180 top
Q3  97.79,82.55 180 top
Q4  115.57,82.55 180 top
R1  66.04,222.25 0 top
R2  72.39,53.34 0 top
R3  86.36,50.8 180 top
R4  11.43,41.91 270 top
R5  8.89,179.07 180 top
R6  8.89,184.15 180 top
R7  8.89,189.23 180 top
R8  8.89,194.31 180 top
R9  8.89,199.39 180 top
R10  8.89,204.47 180 top
R11  8.89,209.55 180 top
R12  8.89,214.63 180 top
R13  8.89,219.71 180 top
R14  8.89,224.79 180 top
R15  71.12,83.82 270 top
R16  90.17,83.82 270 top
R17  106.68,83.82 270 top
R18  125.73,83.82 270 top
R19  88.9,128.27 90 top
R20  114.3,128.27 90 top
R21  49.53,128.27 90 top
R22  101.6,128.27 90 top
R23  62.23,128.27 90 top
R24  76.2,128.27 90 top
R25  76.2,7.62 90 top
R26  64.77,7.62 90 top
R27  53.34,7.62 90 top
R28  40.64,7.62 90 top
R29  13.97,144.78 180 top
R30  13.97,147.32 180 top
RC1  81.28,7.62 90 top
RC6  71.12,7.62 90 top
RC7  59.69,7.62 90 top
RC8  46.99,7.62 90 top
USB  86.36,200.66 270 top
Y1  53.34,185.42 270 top
Y2  11.43,127 0 top

### Tracks (layer width: path | path; a pad name or v marks a point on that pad's centre or on a via)
GND
  Bottom 0.406: C5.2 C6.2 46.99,190.5 48.26,191.77 54.61,191.77 57.15,189.23 IC1.12 60.96,189.23 66.04,194.31 IC1.31 USB.6 88.9,194.31 93.98,199.39 93.98,207.01 97.79,210.82 97.79,219.71 ICSP.3 | PWM.2 PWM.4 63.5,163.83 63.5,171.45 62.23,172.72 57.15,172.72 54.61,175.26 54.61,180.34 53.34,181.61 48.26,181.61 C5.2 | LSP24.MP 44.45,184.15 45.72,182.88 C5.2
N$1
  Bottom 0.406: C5.1 52.07,182.88 52.2,183.01 Y1.2 54.48,184.15 IC1.14
N$2
  Bottom 0.406: R4.2 LED1.K
N$3
  Bottom 0.406: PC_A.1 80.01,163.83 81.28,165.1 81.28,166.37 80.01,167.64 73.66,167.64 72.39,166.37 68.58,166.37 68.58,175.26 62.23,181.61 IC1.15
N$4
  Bottom 0.406: IC1.33 PB_A.1
N$5
  Bottom 0.406: IC1.34 PB_A.2
N$6
  Bottom 0.406: IC1.35 PB_A.3
N$7
  Bottom 0.406: IC1.36 PB_A.4
N$8
  Bottom 0.406: PA_A.1 55.88,215.9 57.15,214.63 IC1.2
N$9
  Bottom 0.406: PA_A.2 55.88,213.36 57.15,212.09 IC1.3
N$10
  Bottom 0.406: PA_A.3 55.88,210.82 57.15,209.55 IC1.4
N$11
  Bottom 0.406: PA_A.4 55.88,208.28 57.15,207.01 IC1.5
N$12
  Bottom 0.406: PA_A.5 55.88,205.74 57.15,204.47 IC1.6
N$13  (via drill 0.6 pad 1.27)
  Top 0.406: v88.9,168.91 v88.9,162.56
  Bottom 0.406: IC1.7 57.15,201.93 55.88,203.2 PA_A.6 49.53,203.2 48.26,201.93 48.26,196.85 44.45,196.85 41.91,194.31 41.91,184.15 46.99,179.07 52.07,179.07 53.34,177.8 53.34,173.99 55.88,171.45 55.88,163.83 62.23,157.48 86.36,157.48 88.9,160.02 v88.9,162.56 | MSSP.4 v88.9,168.91
N$14
  Bottom 0.406: DISPLAY_DATA.5 82.55,41.91 80.01,44.45 DSPHD44780.6
N$15
  Bottom 0.406: IC1.1 58.42,220.98 59.69,222.25 R1.1 60.96,224.79 63.5,227.33 92.71,227.33 ICSP.1
N$16
  Bottom 0.406: DISPLAY_DATA.6 80.01,41.91 77.47,44.45 DSPHD44780.5
N$17
  Bottom 0.406: PD_A.1 96.52,168.91 93.98,166.37 85.09,166.37 85.09,161.29 83.82,160.02 63.5,160.02 62.23,161.29 62.23,170.18 60.96,171.45 IC1.19
N$18
  Bottom 0.406: IC1.37 PB_A.5
N$19
  Bottom 0.406: IC1.38 PB_A.6
N$20
  Bottom 0.406: IC1.39 PB_A.7 ICSP.5
N$21
  Bottom 0.406: IC1.40 PB_A.8 ICSP.4
N$22
  Bottom 0.406: DSPHD44780.15 102.87,48.26 100.33,50.8 R3.1
N$23
  Bottom 0.406: PD_A.2 99.06,172.72 99.06,168.91 95.25,165.1 86.36,165.1 86.36,161.29 83.82,158.75 63.5,158.75 58.42,163.83 IC1.20
N$24
  Bottom 0.406: IC1.16 62.23,179.07 67.31,173.99 PWM.1 72.39,165.1 73.66,166.37 PC_A.2
N$25
  Bottom 0.406: C6.1 52.07,187.96 52.2,187.83 Y1.1 54.48,186.69 IC1.13
N$26
  Bottom 0.406: J1.1 17.78,10.87 | 17.78,10.87 17.78,16.51 | C1.2 17.78,16.51 | 17.78,16.51 17.78,21.59 | C3.- 17.78,21.59 | 17.78,21.59 17.78,27.94 | C2.2 17.78,27.94 | 17.78,27.94 17.78,34.29 | C4.- 17.78,34.29 | 17.78,34.29 17.78,46.99 R4.1 10.16,48.26 GND.16 GND.15 GND.14 | GND.14 10.16,58.42 | GND.14 GND.13 GND.12 GND.11 GND.10 GND.9 GND.8 GND.7 GND.6 GND.5 GND.4 GND.3 GND.2 GND.1 | IC2.2 2.54,22.86 2.54,6.35 5.08,3.81 16.51,3.81 17.78,5.08 17.78,10.87
N$27
  Bottom 0.406: MSSP.3 PC_A.4 76.2,171.45 74.93,170.18 69.85,170.18 69.85,176.53 63.5,182.88 57.15,182.88 55.88,181.61 55.88,175.26 57.15,173.99 IC1.18
N$28
  Bottom 0.406: IC1.23 PC_A.5 MSSP.2
N$29
  Bottom 0.406: IC1.24 PC_A.6 MSSP.1
N$30  (via drill 0.6 pad 1.27)
  Top 0.406: v91.44,181.61 v91.44,201.93
  Bottom 0.406: IC1.25 PC_A.7 88.9,179.07 v91.44,181.61 | USB.3 v91.44,201.93
N$31  (via drill 0.6 pad 1.27)
  Top 0.406: v88.9,181.61 v88.9,204.47
  Bottom 0.406: IC1.26 PC_A.8 v88.9,181.61 | USB.2 v88.9,204.47
N$32
  Bottom 0.406: IC1.21 77.47,170.18 93.98,170.18 93.98,177.8 PD_A.3
N$33
  Bottom 0.406: PD_A.4 93.98,180.34 92.71,179.07 90.17,179.07 88.9,177.8 71.12,177.8 71.12,171.45 IC1.22
N$34
  Bottom 0.406: IC1.27 81.28,184.15 82.55,182.88 PD_A.5
N$35  (1 unrouted)
  Bottom 0.406: IC1.28 81.28,186.69 82.55,185.42 PD_A.6 104.14,185.42
N$36
  Bottom 0.406: IC1.29 81.28,189.23 82.55,187.96 PD_A.7 ECCP.3
N$37
  Bottom 0.406: IC1.30 81.28,191.77 82.55,190.5 PD_A.8 ECCP.4
N$38  (via drill 0.6 pad 1.27)
  Top 0.406: v87.63,167.64 v87.63,163.83
  Bottom 0.406: IC1.17 62.23,176.53 64.77,173.99 PWM.3 66.04,163.83 74.93,163.83 77.47,161.29 82.55,161.29 83.82,162.56 83.82,168.91 | 83.82,168.91 87.63,168.91 v87.63,167.64 | 83.82,168.91 PC_A.3 | ECCP.1 100.33,180.34 100.33,168.91 95.25,163.83 v87.63,163.83
N$39
  Bottom 0.406: JP17.1 OK5.1
N$40
  Bottom 0.406: Q1.1 68.58,82.55 71.12,80.01 R15.2
N$41
  Bottom 0.406: LED2.K R5.1
N$42
  Bottom 0.406: LED3.K R6.1
N$43
  Bottom 0.406: LED4.K R7.1
N$44
  Bottom 0.406: LED5.K R8.1
N$45
  Bottom 0.406: LED6.K R9.1
N$46
  Bottom 0.406: LED7.K R10.1
N$47
  Bottom 0.406: R11.1 LED8.K
N$48
  Bottom 0.406: R12.1 LED9.K
N$49
  Bottom 0.406: R13.1 LED10.K
N$50
  Bottom 0.406: R14.1 LED11.K
N$51
  Bottom 0.406: R15.1 JP3.1
N$52
  Bottom 0.406: LED2.A 21.59,181.61 21.59,186.69 25.4,190.5 IO-OUT.10
N$53
  Bottom 0.406: LED3.A 20.32,185.42 20.32,187.96 22.86,190.5 22.86,195.58 IO-OUT.9
N$54
  Bottom 0.406: LED4.A 21.59,191.77 21.59,196.85 22.86,198.12 IO-OUT.8
N$55
  Bottom 0.406: LED5.A 19.05,196.85 22.86,200.66 IO-OUT.7
N$56
  Bottom 0.406: LED6.A 20.32,200.66 20.32,201.93 21.59,203.2 IO-OUT.6
N$57
  Bottom 0.406: LED7.A 20.32,205.74 IO-OUT.5
N$58
  Bottom 0.406: LED8.A 21.59,209.55 22.86,208.28 IO-OUT.4
N$59
  Bottom 0.406: LED9.A 21.59,214.63 21.59,212.09 22.86,210.82 IO-OUT.3
N$60
  Bottom 0.406: LED10.A 21.59,219.71 22.86,218.44 22.86,214.63 24.13,213.36 IO-OUT.2
N$61
  Bottom 0.406: LED11.A 21.59,222.25 25.4,222.25 IO-OUT.1
N$62
  Bottom 0.406: JP4.2 JP5.1 Q1.2
N$63
  Bottom 0.406: JP18.1 OK1.1
N$64
  Bottom 0.406: JP19.1 OK2.1
N$65
  Bottom 0.406: JP5.2 64.77,87.63 D1.A
N$66
  Bottom 0.406: JP20.1 OK4.1
N$67
  Bottom 0.406: Q2.1 87.63,82.55 90.17,80.01 R16.2
N$68
  Bottom 0.406: R16.1 JP6.1
N$69
  Bottom 0.406: JP7.2 JP8.1 Q2.2
N$70
  Bottom 0.406: JP8.2 83.82,87.63 D2.A
N$71
  Bottom 0.406: R17.2 102.87,82.55 Q3.1
N$72
  Bottom 0.406: R17.1 107.95,90.17 JP9.1
N$73
  Bottom 0.406: JP10.2 JP11.1 Q3.2
N$74
  Bottom 0.406: JP11.2 101.6,87.63 D3.A
N$75
  Bottom 0.406: Q4.1 124.46,82.55 125.73,81.28 R18.2
N$76
  Bottom 0.406: R18.1 127,90.17 JP12.1
N$77
  Bottom 0.406: Q4.2 JP14.1 | 115.57,90.17 JP14.1 | JP13.2 JP14.1
N$78
  Bottom 0.406: JP14.2 120.65,86.36 D4.A
N$79
  Bottom 0.406: OK5.6 LSP1.MP
N$80
  Bottom 0.406: OK5.4 LSP2.MP
N$81
  Bottom 0.406: LSP3.MP OK1.6
N$82
  Bottom 0.406: LSP4.MP OK1.4
N$83
  Bottom 0.406: OK2.6 LSP5.MP
N$84
  Bottom 0.406: OK2.4 LSP6.MP
N$85
  Bottom 0.406: OK4.6 LSP7.MP
N$86
  Bottom 0.406: OK4.4 LSP8.MP
N$87
  Bottom 0.406: OK3.6 LSP9.MP
N$88
  Bottom 0.406: OK3.4 LSP10.MP
N$89
  Bottom 0.406: OK6.6 LSP11.MP
N$90
  Bottom 0.406: OK6.4 LSP12.MP
N$91
  Bottom 0.406: JP21.1 OK3.1
N$92
  Bottom 0.406: OK2.2 43.18,121.92 44.45,120.65 48.26,120.65 49.53,121.92 R21.1
N$93
  Bottom 0.406: OK1.2 107.95,121.92 109.22,120.65 113.03,120.65 114.3,121.92 R20.1
N$94
  Bottom 0.406: R19.1 88.9,121.92 87.63,120.65 83.82,120.65 82.55,121.92 OK5.2
N$95
  Bottom 0.406: JP16.1 OK6.1
N$96
  Bottom 0.406: OK3.2 55.88,121.92 57.15,120.65 60.96,120.65 62.23,121.92 R23.1
N$97
  Bottom 0.406: OK4.2 68.58,121.92 69.85,120.65 74.93,120.65 76.2,121.92 R24.1
N$98
  Bottom 0.406: OK6.2 95.25,121.92 96.52,120.65 100.33,120.65 101.6,121.92 R22.1
N$99
  Bottom 0.406: DISPLAY_DATA.1 96.52,41.91 100.33,43.18 DSPHD44780.14
N$100
  Bottom 0.406: RC1.1 R25.2
N$101
  Bottom 0.406: R26.2 RC6.1
N$102
  Bottom 0.406: R27.2 RC7.1
N$103
  Bottom 0.406: R28.2 RC8.1
N$104
  Bottom 0.406: DISPLAY_DATA.2 91.44,40.64 96.52,43.18 97.79,44.45 DSPHD44780.13
N$105
  Bottom 0.406: DISPLAY_DATA.3 87.63,41.91 88.9,41.91 95.25,44.45 DSPHD44780.12
N$106
  Bottom 0.406: DISPLAY_DATA.4 85.09,43.18 90.17,43.18 92.71,44.45 DSPHD44780.11
N$107
  Bottom 0.406: DISPLAY_DATA.7 77.47,41.91 74.93,44.45 DSPHD44780.4
N$108
  Bottom 0.406: PE_0.2 IC1.9
N$109
  Bottom 0.406: DSPHD44780.3 R2.2
N$110
  Bottom 0.406: PE_0.3 IC1.8
N$111
  Bottom 0.406: PE_0.1 IC1.10
N$112
  Bottom 0.406: R1.2 72.39,220.98 86.36,220.98 87.63,219.71 D5.C
N$113
  Bottom 0.406: IC3.6 JP1.2 R29.1
N$114
  Bottom 0.406: IC3.5 JP1.1 20.32,143.51 20.32,146.05 R30.1
N$115
  Bottom 0.406: LSP17.MP R30.2 R29.2 8.89,138.43 IC3.8
N$116
  Bottom 0.406: IC3.7 12.7,138.43 11.43,139.7 JP2.1
N$117
  Bottom 0.406: IC3.3 15.24,125.73 20.32,120.65 20.32,113.03 22.86,110.49 G1.+
N$118
  Bottom 0.406: JP4.1 60.96,96.52 62.23,97.79 D1.C 80.01,97.79 | 80.01,97.79 D2.C 97.79,97.79 | JP7.1 80.01,97.79 | 97.79,97.79 D3.C 115.57,97.79 | JP10.1 97.79,97.79 | 115.57,97.79 121.92,97.79 | 121.92,97.79 LSP13.MP | D4.C 121.92,97.79 | JP13.1 115.57,97.79
N$119
  Bottom 0.406: Q1.3 58.42,77.47 60.96,74.93 77.47,74.93 | 77.47,74.93 95.25,74.93 | 95.25,74.93 113.03,74.93 | 113.03,74.93 130.81,74.93 132.08,76.2 132.08,83.82 LSP14.MP | Q2.3 77.47,74.93 | Q3.3 95.25,74.93 | Q4.3 113.03,74.93
N$120
  Bottom 0.406: Y2.1 IC3.1
N$121
  Bottom 0.406: Y2.2 IC3.2
N$122
  Bottom 0.406: R21.2 49.53,138.43 52.07,140.97 62.23,140.97 | 62.23,140.97 76.2,140.97 | 76.2,140.97 88.9,140.97 | 88.9,140.97 101.6,140.97 | 101.6,140.97 111.76,140.97 114.3,138.43 R20.2 119.38,128.27 119.38,120.65 LSP15.MP | R23.2 62.23,140.97 | R24.2 76.2,140.97 | R19.2 88.9,140.97 | R22.2 101.6,140.97
N$123
  Bottom 0.406: R14.2 R13.2 R12.2 R11.2 R10.2 R9.2 R8.2 R7.2 R6.2 R5.2 LSP18.MP
N$124
  Bottom 0.406: R28.3 R27.3 R26.3 R25.3 LSP16.MP
N$125
  Bottom 0.406: LSP20.MP 99.06,35.56 68.58,35.56 67.31,36.83 DSPHD44780.1 67.31,52.07 68.58,53.34 R2.1 71.12,54.61 77.47,54.61 R3.2
N$126
  Bottom 0.406: LSP19.MP 105.41,44.45 | 105.41,44.45 DSPHD44780.16 | DSPHD44780.2 69.85,50.8 72.39,53.34 R2.3 78.74,49.53 81.28,49.53 82.55,48.26 DSPHD44780.7 DSPHD44780.8 DSPHD44780.9 DSPHD44780.10 91.44,48.26 91.44,49.53 100.33,49.53 101.6,48.26 101.6,44.45 105.41,44.45
N$127
  Bottom 0.406: IC3.4 17.78,132.08 16.51,133.35 15.24,133.35 13.97,134.62 | 13.97,134.62 13.97,144.78 16.51,147.32 LSP22.MP | G1.- 7.62,117.48 7.62,130.81 10.16,133.35 13.97,133.35 13.97,134.62
N$128  (1 unrouted)
  Bottom 0.406: R28.1 R27.1 R26.1 R25.1 91.44,5.08
N$129
  Bottom 0.406: C1.1 11.43,12.7 10.97,12.24 J1.3 | C1.1 12.7,17.78 C3.+ 11.43,21.59 8.89,24.13 2.54,24.13 2.54,48.26 +12.1 +12.2 +12.3 +12.4 +12.5 +12.6 +12.7 +12.8 +12.9 +12.10 +12.11 +12.12 +12.13 +12.14 +12.15 +12.16 | IC2.1 10.16,16.51 C1.1
N$130
  Bottom 0.406: D5.A 92.71,208.28 92.71,200.66 91.44,199.39 USB.4 85.09,199.39 82.55,196.85 IC1.32 66.04,196.85 60.96,191.77 IC1.11 57.15,191.77 55.88,193.04 45.72,193.04 LSP23.MP
N$131  (via drill 0.6 pad 1.27)
  Top 0.406: v15.24,49.53 v8.89,49.53
  Bottom 0.406: IC2.3 8.89,27.94 C2.1 10.16,30.48 8.89,31.75 C4.+ 5.08,38.1 LED1.A 5.08,46.99 7.62,49.53 v8.89,49.53 | +5.1 +5.2 +5.3 +5.4 +5.5 +5.6 +5.7 +5.8 +5.9 +5.10 +5.11 +5.12 +5.13 +5.14 +5.15 +5.16 15.24,52.07 v15.24,49.53